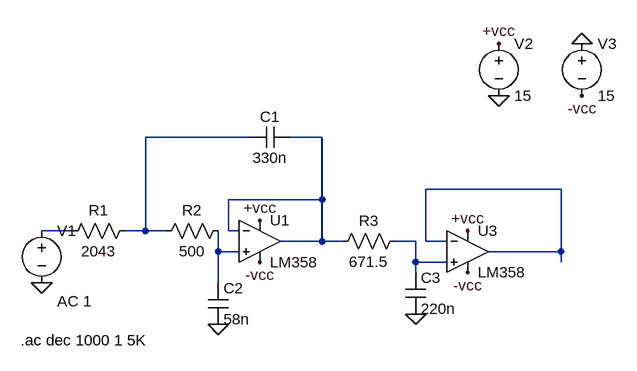
[diagram p0: schematic F-P-B v.c.asc]
F-P-B v.c.asc, the LTspice schematic file:
Version 4
SHEET 1 880 680
WIRE 192 -16 32 -16
WIRE 304 -16 256 -16
WIRE 672 64 464 64
WIRE 304 80 304 -16
WIRE 304 80 160 80
WIRE -80 128 -128 128
WIRE 32 128 32 -16
WIRE 32 128 0 128
WIRE 64 128 32 128
WIRE 160 128 160 80
WIRE 176 128 160 128
WIRE 304 144 304 80
WIRE 304 144 240 144
WIRE 336 144 304 144
WIRE 448 144 416 144
WIRE 464 144 464 64
WIRE 496 144 464 144
WIRE 144 160 144 128
WIRE 176 160 144 160
WIRE 672 160 672 64
WIRE 672 160 560 160
WIRE 448 176 448 144
WIRE 496 176 448 176
WIRE 672 176 672 160
WIRE 448 192 448 176
WIRE 144 208 144 160
FLAG 576 -80 0
FLAG 704 -160 0
FLAG -128 208 0
FLAG 144 272 0
FLAG 448 256 0
FLAG 576 -160 +vcc
FLAG 208 112 +vcc
FLAG 528 128 +vcc
FLAG 528 192 -vcc
FLAG 208 176 -vcc
FLAG 704 -80 -vcc
SYMBOL res 160 112 R90
WINDOW 0 0 56 VBottom 2
WINDOW 3 32 56 VTop 2
SYMATTR InstName R2
SYMATTR Value 500
SYMBOL res 16 112 R90
WINDOW 0 0 56 VBottom 2
WINDOW 3 32 56 VTop 2
SYMATTR InstName R1
SYMATTR Value 2043
SYMBOL cap 128 208 R0
SYMATTR InstName C2
SYMATTR Value 58n
SYMBOL cap 256 -32 R90
WINDOW 0 0 32 VBottom 2
WINDOW 3 32 32 VTop 2
SYMATTR InstName C1
SYMATTR Value 330n
SYMBOL voltage -128 112 R0
WINDOW 123 24 124 Left 2
WINDOW 39 0 0 Left 0
SYMATTR Value2 AC 1
SYMATTR InstName V1
SYMATTR Value ""
SYMBOL voltage 576 -176 R0
WINDOW 123 0 0 Left 0
WINDOW 39 0 0 Left 0
SYMATTR InstName V2
SYMATTR Value 15
SYMBOL voltage 704 -176 R0
WINDOW 123 0 0 Left 0
WINDOW 39 0 0 Left 0
SYMATTR InstName V3
SYMATTR Value 15
SYMBOL res 432 128 R90
WINDOW 0 0 56 VBottom 2
WINDOW 3 32 56 VTop 2
SYMATTR InstName R3
SYMATTR Value 671.5
SYMBOL cap 432 192 R0
SYMATTR InstName C3
SYMATTR Value 220n
SYMBOL Opamps\\LM358 208 80 R0
SYMATTR InstName U1
SYMBOL Opamps\\LM358 528 96 R0
SYMATTR InstName U3
TEXT -160 296 Left 2 !.ac dec 1000 1 5K

The netlist it stands for:
* F-P-B v.c.asc
R2 N006 N001 500
R1 N001 N004 2043
C2 N006 0 58n
C1 N002 N001 330n
V1 N004 0 AC 1
V2 +vcc 0 15
V3 0 -vcc 15
R3 N005 N002 671.5
C3 N005 0 220n
XU1 N006 N002 +vcc -vcc N002 LM358  ; pins In+ In- V+ V- OUT
XU3 N005 N003 +vcc -vcc N003 LM358  ; pins In+ In- V+ V- OUT
.ac dec 1000 1 5K
.backanno
.end